# EAGLE schematic untitled (EAGLE 9.6.2)
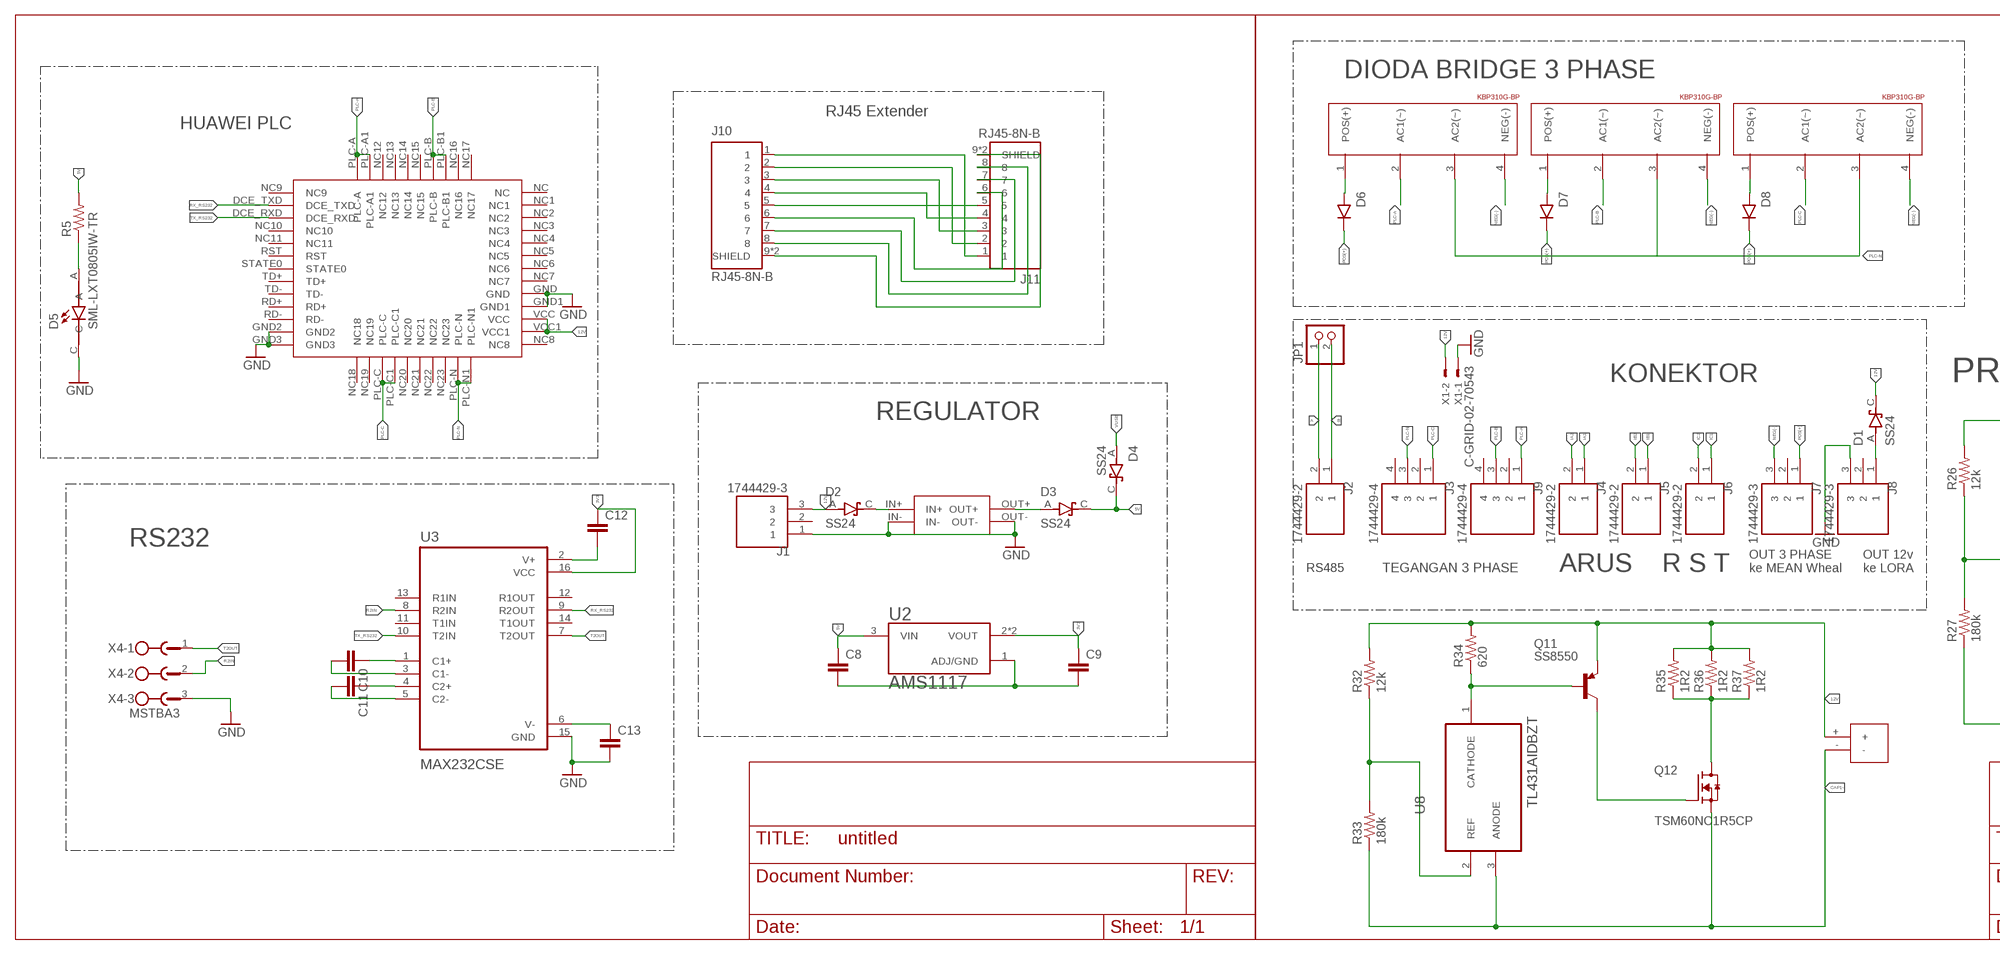
[diagram p0: schematic, sheet 1, part 1 of 2]
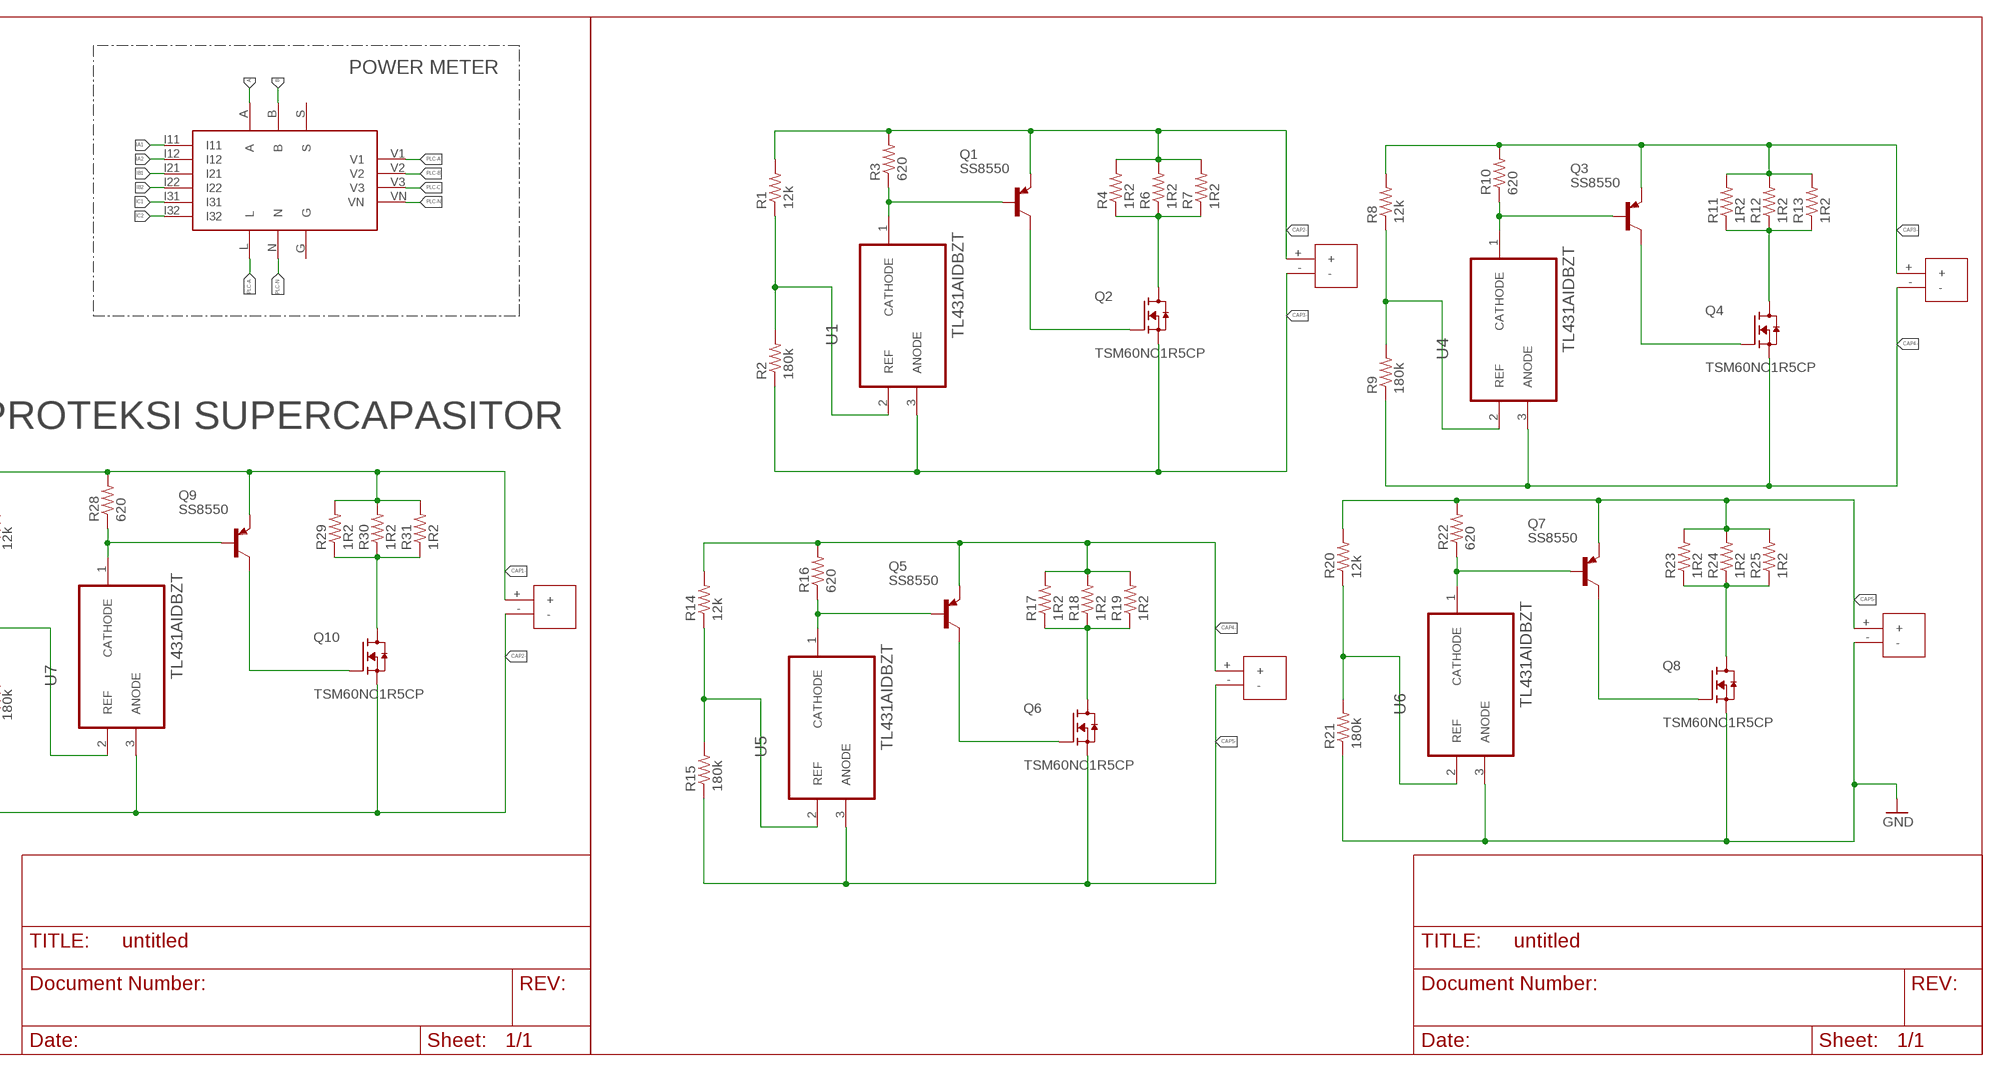
[diagram p1: schematic, sheet 1, part 2 of 2]

## Parts
C8  C-EUC0805K  [C0805K]
C9  C-EUC0805K  [C0805K]
C10  C-EUC0805K  [C0805K]
C11  C-EUC0805K  [C0805K]
C12  C-EUC0805K  [C0805K]
C13  C-EUC0805K  [C0805K]
D1  SS24  [DIOM5336X265N]
D2  SS24  [DIOM5336X265N]
D3  SS24  [DIOM5336X265N]
D4  SS24  [DIOM5336X265N]
D5  SML-LXT0805IW-TR  [LEDC2012X120N]
D6  1N4001  [DO41-10]
D7  1N4001  [DO41-10]
D8  1N4001  [DO41-10]
HUAWEI-PLC1  HUAWEI-PLC  [HUAWEI-PLC]
J1  1744429-3  [TE_1744429-3]
J2  1744429-2  [TE_1744429-2]
J3  1744429-4  [TE_1744429-4]
J4  1744429-2  [TE_1744429-2]
J5  1744429-2  [TE_1744429-2]
J6  1744429-2  [TE_1744429-2]
J7  1744429-3  [TE_1744429-3]
J8  1744429-3  [TE_1744429-3]
J9  1744429-4  [TE_1744429-4]
J10  RJ45-8N-B  [TE_RJ45-8N-B]
J11  RJ45-8N-B  [TE_RJ45-8N-B]
JP1  PINHD-1X2  [1X02]
MINI1  MINI560  [MINI560]
POWERMETER1  POWERMETER  [POWERMETER]
Q1  SS8550  [SOT-23_BEC]
Q2  TSM60NC1R5CP  [TRANS_TSM60NC1R5CP]
Q3  SS8550  [SOT-23_BEC]
Q4  TSM60NC1R5CP  [TRANS_TSM60NC1R5CP]
Q5  SS8550  [SOT-23_BEC]
Q6  TSM60NC1R5CP  [TRANS_TSM60NC1R5CP]
Q7  SS8550  [SOT-23_BEC]
Q8  TSM60NC1R5CP  [TRANS_TSM60NC1R5CP]
Q9  SS8550  [SOT-23_BEC]
Q10  TSM60NC1R5CP  [TRANS_TSM60NC1R5CP]
Q11  SS8550  [SOT-23_BEC]
Q12  TSM60NC1R5CP  [TRANS_TSM60NC1R5CP]
R1  12k  R-US_R0805  [R0805]
R2  180k  R-US_R0805  [R0805]
R3  620  R-US_R0805  [R0805]
R4  1R2  R-US_R2512  [R2512]
R5  R-US_M0805  [M0805]
R6  1R2  R-US_R2512  [R2512]
R7  1R2  R-US_R2512  [R2512]
R8  12k  R-US_R0805  [R0805]
R9  180k  R-US_R0805  [R0805]
R10  620  R-US_R0805  [R0805]
R11  1R2  R-US_R2512  [R2512]
R12  1R2  R-US_R2512  [R2512]
R13  1R2  R-US_R2512  [R2512]
R14  12k  R-US_R0805  [R0805]
R15  180k  R-US_R0805  [R0805]
R16  620  R-US_R0805  [R0805]
R17  1R2  R-US_R2512  [R2512]
R18  1R2  R-US_R2512  [R2512]
R19  1R2  R-US_R2512  [R2512]
R20  12k  R-US_R0805  [R0805]
R21  180k  R-US_R0805  [R0805]
R22  620  R-US_R0805  [R0805]
R23  1R2  R-US_R2512  [R2512]
R24  1R2  R-US_R2512  [R2512]
R25  1R2  R-US_R2512  [R2512]
R26  12k  R-US_R0805  [R0805]
R27  180k  R-US_R0805  [R0805]
R28  620  R-US_R0805  [R0805]
R29  1R2  R-US_R2512  [R2512]
R30  1R2  R-US_R2512  [R2512]
R31  1R2  R-US_R2512  [R2512]
R32  12k  R-US_R0805  [R0805]
R33  180k  R-US_R0805  [R0805]
R34  620  R-US_R0805  [R0805]
R35  1R2  R-US_R2512  [R2512]
R36  1R2  R-US_R2512  [R2512]
R37  1R2  R-US_R2512  [R2512]
SUPERCAP1  2.7/500F  SUPERCAP  [SUPERCAP]
SUPERCAP2  2.7/500F  SUPERCAP  [SUPERCAP]
SUPERCAP3  2.7/500F  SUPERCAP  [SUPERCAP]
SUPERCAP4  2.7/500F  SUPERCAP  [SUPERCAP]
SUPERCAP5  2.7/500F  SUPERCAP  [SUPERCAP]
SUPERCAP6  2.7/500F  SUPERCAP  [SUPERCAP]
U1  TL431AIDBZT  [SOT95P237X112-3N]
U2  AMS1117  [SOT229P700X180-4N]
U3  MAX232CSE  [SOIC127P600X175-16N]
U4  TL431AIDBZT  [SOT95P237X112-3N]
U5  TL431AIDBZT  [SOT95P237X112-3N]
U6  TL431AIDBZT  [SOT95P237X112-3N]
U7  TL431AIDBZT  [SOT95P237X112-3N]
U8  TL431AIDBZT  [SOT95P237X112-3N]
U$1  KBP310G-BP  [KBP310G-BP]
U$2  KBP310G-BP  [KBP310G-BP]
U$3  KBP310G-BP  [KBP310G-BP]
X1  C-GRID-02-70543  [70543-02]
X4  MSTBA3  [MSTBA3]

## Nets
3V3: C9.1 C12.1 U2.2(VOUT) U2.4(VOUT) U3.16(VCC)
5V: C8.1 D3.C(K) D4.C(K) R5.2 U2.3(VIN)
12V: D1.C(K) D2.A HUAWEI-PLC1.VCC HUAWEI-PLC1.VCC1 J1.3 Q11.E R32.2 R34.2 R35.2 R36.2 R37.2 SUPERCAP6.+ X1.2
A: J2.2 JP1.1 POWERMETER1.A
B: J2.1 JP1.2 POWERMETER1.B
CAP1-: Q9.E Q12.3(S) R26.2 R28.2 R29.2 R30.2 R31.2 R33.1 SUPERCAP5.+ SUPERCAP6.- U8.3(ANODE)
CAP2-: Q1.E Q10.3(S) R1.2 R3.2 R4.2 R6.2 R7.2 R27.1 SUPERCAP1.+ SUPERCAP5.- U7.3(ANODE)
CAP3-: Q2.3(S) Q3.E R2.1 R8.2 R10.2 R11.2 R12.2 R13.2 SUPERCAP1.- SUPERCAP2.+ U1.3(ANODE)
CAP4-: Q4.3(S) Q5.E R9.1 R14.2 R16.2 R17.2 R18.2 R19.2 SUPERCAP2.- SUPERCAP3.+ U4.3(ANODE)
CAP5-: Q6.3(S) Q7.E R15.1 R20.2 R22.2 R23.2 R24.2 R25.2 SUPERCAP3.- SUPERCAP4.+ U5.3(ANODE)
GND: C13.2 D5.C HUAWEI-PLC1.GND HUAWEI-PLC1.GND1 HUAWEI-PLC1.GND2 HUAWEI-PLC1.GND3 J1.1 J8.3 MINI1.IN- MINI1.OUT- Q8.3(S) R21.1 SUPERCAP4.- U3.15(GND) U6.3(ANODE) X1.1 X4.3
IA1: J4.1 POWERMETER1.I11
IA2: J4.2 POWERMETER1.I12
IB1: J5.1 POWERMETER1.I21
IB2: J5.2 POWERMETER1.I22
IC1: J6.1 POWERMETER1.I31
IC2: J6.2 POWERMETER1.I32
N$1: D6.A(ANODE) U$1.1(POS(+))
N$2: D7.A(ANODE) U$2.1(POS(+))
N$3: D8.A(ANODE) U$3.1(POS(+))
N$4: R8.1 R9.2 U4.2(REF)
N$5: J10.1 J11.1
N$6: R1.1 R2.2 U1.2(REF)
N$7: D2.C(K) MINI1.IN+
N$8: C8.2 C9.2 U2.1(ADJ/GND)
N$9: D3.A MINI1.OUT+
N$10: J10.2 J11.2
N$11: C10.1 U3.1(C1+)
N$12: C10.2 U3.3(C1-)
N$13: C11.1 U3.4(C2+)
N$14: C11.2 U3.5(C2-)
N$15: C13.1 U3.6(V-)
N$16: D1.A J8.1
N$17: C12.2 U3.2(V+)
N$18: Q1.B R3.1 U1.1(CATHODE)
N$19: D5.A R5.1
N$20: Q1.C Q2.1(G)
N$21: Q2.2(D) R4.1 R6.1 R7.1
N$22: J10.3 J11.3
N$23: J10.4 J11.4
N$24: J10.5 J11.5
N$25: Q3.B R10.1 U4.1(CATHODE)
N$26: Q3.C Q4.1(G)
N$27: Q4.2(D) R11.1 R12.1 R13.1
N$28: J10.6 J11.6
N$29: R14.1 R15.2 U5.2(REF)
N$30: J10.7 J11.7
N$31: Q5.B R16.1 U5.1(CATHODE)
N$32: Q5.C Q6.1(G)
N$33: Q6.2(D) R17.1 R18.1 R19.1
N$34: J10.8 J11.8
N$35: R20.1 R21.2 U6.2(REF)
N$36: J10.9(SHIELD) J10.10(SHIELD) J11.9(SHIELD) J11.10(SHIELD)
N$37: Q7.B R22.1 U6.1(CATHODE)
N$38: Q7.C Q8.1(G)
N$39: Q8.2(D) R23.1 R24.1 R25.1
N$41: R26.1 R27.2 U7.2(REF)
N$43: Q9.B R28.1 U7.1(CATHODE)
N$44: Q9.C Q10.1(G)
N$45: Q10.2(D) R29.1 R30.1 R31.1
N$47: R32.1 R33.2 U8.2(REF)
N$49: Q11.B R34.1 U8.1(CATHODE)
N$50: Q11.C Q12.1(G)
N$51: Q12.2(D) R35.1 R36.1 R37.1
NEG(-): J7.3 U$1.4(NEG(-)) U$2.4(NEG(-)) U$3.4(NEG(-))
PLC-A: HUAWEI-PLC1.PLC-A HUAWEI-PLC1.PLC-A1 J9.1 POWERMETER1.L POWERMETER1.V1 U$1.2(AC1(~))
PLC-B: HUAWEI-PLC1.PLC-B HUAWEI-PLC1.PLC-B1 J9.3 POWERMETER1.V2 U$2.2(AC1(~))
PLC-C: HUAWEI-PLC1.PLC-C HUAWEI-PLC1.PLC-C1 J3.1 POWERMETER1.V3 U$3.2(AC1(~))
PLC-N: HUAWEI-PLC1.PLC-N HUAWEI-PLC1.PLC-N1 J3.3 POWERMETER1.N POWERMETER1.VN U$1.3(AC2(~)) U$2.3(AC2(~)) U$3.3(AC2(~))
POS(+): D6.C(CATHODE) D7.C(CATHODE) D8.C(CATHODE) J7.1
R2IN: U3.8(R2IN) X4.2
RX_RS232: HUAWEI-PLC1.DCE_TXD U3.9(R2OUT)
T2OUT: U3.7(T2OUT) X4.1
TX_RS232: HUAWEI-PLC1.DCE_RXD U3.10(T2IN)
VUSB: D4.A
Unconnected: HUAWEI-PLC1.NC HUAWEI-PLC1.NC1 HUAWEI-PLC1.NC2 HUAWEI-PLC1.NC3 HUAWEI-PLC1.NC4 HUAWEI-PLC1.NC5 HUAWEI-PLC1.NC6 HUAWEI-PLC1.NC7 HUAWEI-PLC1.NC8 HUAWEI-PLC1.NC9 HUAWEI-PLC1.NC10 HUAWEI-PLC1.NC11 HUAWEI-PLC1.NC12 HUAWEI-PLC1.NC13 HUAWEI-PLC1.NC14 HUAWEI-PLC1.NC15 HUAWEI-PLC1.NC16 HUAWEI-PLC1.NC17 HUAWEI-PLC1.NC18 HUAWEI-PLC1.NC19 HUAWEI-PLC1.NC20 HUAWEI-PLC1.NC21 HUAWEI-PLC1.NC22 HUAWEI-PLC1.NC23 HUAWEI-PLC1.RD+ HUAWEI-PLC1.RD- HUAWEI-PLC1.RST HUAWEI-PLC1.STATE0 HUAWEI-PLC1.TD+ HUAWEI-PLC1.TD- J1.2 J3.2 J3.4 J7.2 J8.2 J9.2 J9.4 POWERMETER1.G POWERMETER1.S U3.11(T1IN) U3.12(R1OUT) U3.13(R1IN) U3.14(T1OUT)

## Notes on the sheet
- POWER METER
- DIODA BRIDGE 3 PHASE
- RJ45 Extender
- HUAWEI PLC
- KONEKTOR | PROTEKSI SUPERCAPASITOR
- REGULATOR
- RS232
- RS485 | TEGANGAN 3 PHASE | ARUS    R S T
- OUT 3 PHASE 
  ke MEAN Wheal
- OUT 12v
  ke LORA

## Library data of the parts
C8-C13 = rcl:C-EU: CAPACITOR, European symbol; SPICEPREFIX: C
D1-D4 = SS24:SS24: Diode Schottky 40V 2A Surface Mount DO-214AA (SMB) Check availability <https://pricing.snapeda.com/parts/SS24/ON%20Semiconductor/view-part?ref=eda>; AVAILABILITY: In Stock; CHECK_PRICES: https://www.snapeda.com/parts/SS24/Onsemi/view-part/?ref=eda; DESCRIPTION: Diode Schottky 40V 2A Surface Mount DO-214AA (SMB); MF: ON Semiconductor; MP: SS24; PACKAGE: DO-214AA ON Semiconductor; PRICE: None; SNAPEDA_LINK: https://www.snapeda.com/parts/SS24/Onsemi/view-part/?ref=snap
D5 = SML-LXT0805IW-TR:SML-LXT0805IW-TR: LED; Luminous Intensity:11µcd; Viewing Angle:140°; Forward Current:30mA; Forward Voltage:2V; Color:Red; LED Color:Red; Leaded Process Compatible:Yes; Lens Color:White; Mounting Type:Surface Mount ;RoHS Compliant: Yes Check availability <https://pricing.snapeda.com/parts/SML-LXT0805IW-TR/Lumex%20Opto/Components/view-part?ref=eda>; AVAILABILITY: In Stock; DESCRIPTION: Red - LED Indication - Discrete 2V 0805 (2012 Metric); MF: Lumex Opto/Components; MP: SML-LXT0805IW-TR; PACKAGE: 0805 Lumex; PRICE: None; PURCHASE-URL: https://pricing.snapeda.com/search/part/SML-LXT0805IW-TR/?ref=eda
D6-D8 = 1N4001:1N4001: DIODE general purpose rectifier, 1 A Check availability <https://pricing.snapeda.com/parts/1N4001/HVCA/view-part?ref=eda>; AVAILABILITY: In Stock; CHECK_PRICES: https://www.snapeda.com/parts/1N4001/HVCA/view-part/?ref=eda; DESCRIPTION: Diode, Rectifier, Vr 50V, If 1A, Pkg DO-41, Vf 1.1V, Cs 30A, Ir 1A | HVCA 1N4001; MF: HVCA; MP: 1N4001; PACKAGE: None; PRICE: None; SNAPEDA_LINK: https://www.snapeda.com/parts/1N4001/HVCA/view-part/?ref=snap
HUAWEI-PLC1 = HUAWEI-PLC:HUAWEI-PLC
J1 J7 J8 = 1744429-3:1744429-3: 3.96 EP HDR ASSY 6P W/PEGS, GW,NO PIN 3; MANUFACTURER: TE; PARTREV: R; STANDARD: Manufacturer Recommendations
J2 J4-J6 = 1744429-2:1744429-2: 3.96 EP HDR ASSY 6P W/PEGS, GW,NO PIN 3 Check availability <https://pricing.snapeda.com/parts/1744429-2/TE%20Connectivity/view-part?ref=eda>; AVAILABILITY: In Stock; CENTERLINE_PITCH: 3.96 mm[.156 in]; CHECK_PRICES: https://www.snapeda.com/parts/1744429-2/TE+Connectivity+AMP+Connectors/view-part/?ref=eda; COMMENT: 1744429-2; DESCRIPTION: 3.96 EP HDR ASSY 2P W/PEGS, GW; EU_ROHS_COMPLIANCE: Compliant; MF: TE Connectivity; MP: 1744429-2; NUMBER_OF_POSITIONS: 2; PACKAGE: None; PRICE: None; PRODUCT_TYPE: Header; SNAPEDA_LINK: https://www.snapeda.com/parts/1744429-2/TE+Connectivity+AMP+Connectors/view-part/?ref=snap
J3 J9 = 1744429-4:1744429-4: 3.96 EP HDR ASSY 6P W/PEGS, GW,NO PIN 3 Check availability <https://pricing.snapeda.com/parts/1744429-4/TE%20Connectivity/view-part?ref=eda>; AVAILABILITY: In Stock; CHECK_PRICES: https://www.snapeda.com/parts/1744429-4/TE+Connectivity+AMP+Connectors/view-part/?ref=eda; COMMENT: 1744429-4; DESCRIPTION: Conn Wire to Board M 4 POS 3.96mm Solder ST Thru-Hole Bag; EU_ROHS_COMPLIANCE: Compliant; MF: TE Connectivity; MP: 1744429-4; PACKAGE: None; PRICE: None; SNAPEDA_LINK: https://www.snapeda.com/parts/1744429-4/TE+Connectivity+AMP+Connectors/view-part/?ref=snap
J10 J11 = RJ45-8N-B:RJ45-8N-B: RJ Jack / Signal Line EMI/RFI Filters 6 TERM LOW PROFILE BLOCK INDUCTOR 8 PIN Check availability <https://pricing.snapeda.com/parts/RJ45-8N-B/TE%20Connectivity/view-part?ref=eda>; AVAILABILITY: In Stock; DESCRIPTION: Jack Modular Connector 8p8c (RJ45, Ethernet) 90° Angle (Right) Unshielded -; MF: TE Connectivity; MP: RJ45-8N-B; PACKAGE: None; PRICE: None; PURCHASE-URL: https://pricing.snapeda.com/search/part/RJ45-8N-B/?ref=eda
JP1 = pinhead:PINHD-1X2: PIN HEADER
MINI1 = MINI560:MINI560
POWERMETER1 = POWERMETER:POWERMETER
Q1 Q3 Q5 Q7 Q9 Q11 = SS8550:SS8550: PNP de proposito general Vce=-40V, Ic-1.5A - 0.3W Check availability <https://pricing.snapeda.com/parts/SS8550/ON%20Semiconductor%20/%20Fairchild/view-part?ref=eda>; AVAILABILITY: In Stock; DESCRIPTION: Bipolar Transistors - BJT NPN/40V/1.5A; MF: ON Semiconductor / Fairchild; MP: SS8550; PACKAGE: SOT-23 ON Semiconductor / Fairchild; PRICE: None; PURCHASE-URL: https://pricing.snapeda.com/search/part/SS8550/?ref=eda
Q2 Q4 Q6 Q8 Q10 Q12 = TSM60NC1R5CP:TSM60NC1R5CP: Check availability <https://pricing.snapeda.com/parts/TSM60NC1R5CP/Taiwan%20Semiconductor/view-part?ref=eda>; AVAILABILITY: In Stock; CHECK_PRICES: https://www.snapeda.com/parts/TSM60NC1R5CP/Taiwan+Semiconductor/view-part/?ref=eda; DESCRIPTION: 600V, 3A, SINGLE N-CHANNEL POWER; MF: Taiwan Semiconductor; MP: TSM60NC1R5CP; PACKAGE: TO-252 Taiwan Semiconductor; PRICE: None; SNAPEDA_LINK: https://www.snapeda.com/parts/TSM60NC1R5CP/Taiwan+Semiconductor/view-part/?ref=snap
R1-R3 R5 R8-R10 R14-R16 R20-R22 R26-R28 R32-R34 = adafruit:R-US_: RESISTOR, American symbol
R4 R6 R7 R11-R13 R17-R19 R23-R25 R29-R31 R35-R37 = rcl:R-US_: RESISTOR, American symbol; SPICEPREFIX: R
SUPERCAP1-SUPERCAP6 = SUPERCAP:SUPERCAP
U1 U4-U8 = TL431AIDBZT:TL431AIDBZT: PRECISION PROGRAMMABLE REFERENCE Check availability <https://pricing.snapeda.com/parts/TL431AIDBZT/Texas%20Instruments/view-part?ref=eda>; AVAILABILITY: In Stock; CHECK_PRICES: https://www.snapeda.com/parts/TL431AIDBZT/Texas+Instruments/view-part/?ref=eda; DESCRIPTION: Adjustable precision shunt regulator; MF: Texas Instruments; MP: TL431AIDBZT; PACKAGE: SOT-23-3 Texas Instruments; PRICE: None; SNAPEDA_LINK: https://www.snapeda.com/parts/TL431AIDBZT/Texas+Instruments/view-part/?ref=snap
U2 = AMS1117:AMS1117: Sot223/Pkg 1-Amp 5-Volt Low Drop Out Voltage Regulatator Check availability <https://pricing.snapeda.com/parts/AMS1117/Advanced%20Monolithic%20Systems/view-part?ref=eda>; AVAILABILITY: Not in stock; DESCRIPTION: 1A LOW DROPOUT VOLTAGE REGULATOR SOT-223; MF: Advanced Monolithic Systems; MP: AMS1117; PACKAGE: SOT-223 Seeed Technology; PRICE: None
U3 = MAX232CSE:MAX232CSE: Check availability <https://pricing.snapeda.com/parts/MAX232CSE/Maxim%20Integrated/view-part?ref=eda>; AVAILABILITY: In Stock; DESCRIPTION: 2/2 Transceiver Full RS232 16-SOIC; MF: Maxim Integrated; MP: MAX232CSE; PACKAGE: SOIC-16 Maxim Integrated; PRICE: None; PURCHASE-URL: https://pricing.snapeda.com/search/part/MAX232CSE/?ref=eda
U$1-U$3 = KBP310G-BP:KBP310G-BP: Check availability <https://pricing.snapeda.com/parts/KBP310G-BP/Micro%20Commercial/view-part?ref=eda>; AVAILABILITY: In Stock; CHECK_PRICES: https://www.snapeda.com/parts/KBP310G-BP/Micro+Commercial+Components/view-part/?ref=eda; DESCRIPTION: Bridge Rectifier Single Phase Standard 1 kV Through Hole GBP; MF: Micro Commercial; MP: KBP310G-BP; PACKAGE: SIP-4 Micro Commercial Co; PRICE: None; SNAPEDA_LINK: https://www.snapeda.com/parts/KBP310G-BP/Micro+Commercial+Components/view-part/?ref=snap
X1 = con-molex:C-GRID-02: CONNECTOR wire to board 2.54 mm (0.100") pitch header; MF: MOLEX; OC_FARNELL: unknown; OC_NEWARK: unknown
X4 = con-phoenix-508:MSTBA3: PHOENIX; MF: FARNELL; MPN: 1757255; OC_FARNELL: 3705183; OC_NEWARK: 71C4162